# Altium schematic sheet Antena RF.SchDoc: Antena R/F
size A4; CompanyName: MUISE; Engineer: Manuel Viqueira Rodríguez; Organization: ETSI Telecomunicaciones; Address1: Av. Complutense, 30; Address2: , 28040 Madrid; Address3: Madrid; Address4: España; DocumentNumber: 4; Revision: V1.0; SheetNumber: 4; SheetTotal: 8; Engineer2: Marcos Vazquez Nuñez
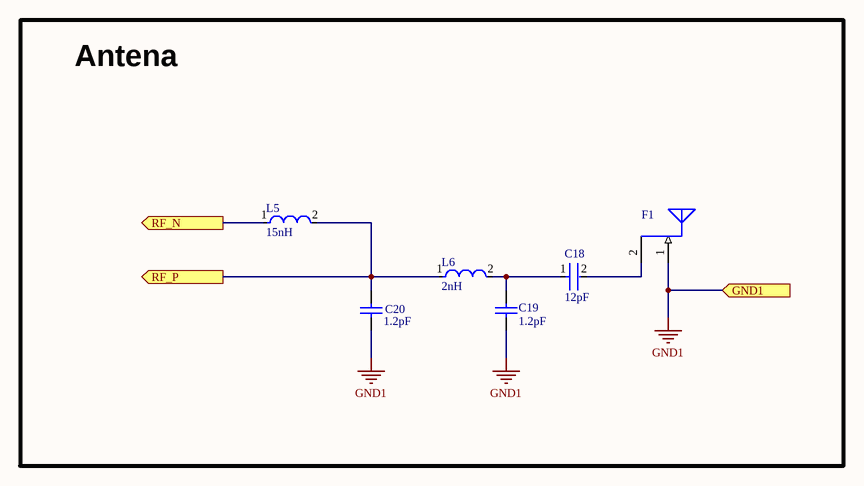
[diagram p0: Antena RF.SchDoc]

## Parts
C18  12pF  [FP-C0603C-CF-MFG]
C19  1.2pF  [CAPC1005X55X25ML05T10]
C20  1.2pF  [CAPC1005X55X25ML05T10]
F1  -  [PCBAntenna]  (value not drawn)  (net tie, no BOM)
L5  15nH  [FP-LQW15AN_00-W0_6-0_1-MFG]
L6  2nH  [FP-LQW15AN_00-W0_6-0_1-MFG]

## Blocks framed on the sheet
Antena: C18-C20 F1 L5 L6

## Ports
GND1 (in), RF_N (out), RF_P (out)

## Nets
GND1: C19.1 C20.1 F1.1(FeedPoint) ; port GND1
RF_N: L5.1 ; port RF_N
RF_P: C20.2 L5.2 L6.1 ; port RF_P
NetC18_1: C18.1 C19.2 L6.2
NetC18_2: C18.2 F1.2(GND)

## Notes on the sheet
- Size:
- Date:
- Title
- A4
- Number:
- Time:
- Revision:
- Sheet
- of
- Engineer
- File:

## Library data of the parts
C18 = CMP-1035-00616-2: CAP CER 12PF 50V NP0 0603; Manufacturer: KEMET; Manufacturer Part Number: C0603C120D5GACTU; Temperature Characteristic: C0G; Tolerance: 0.5 pF; Automotive Grade: Grade 1; Material: Ceramic; Temperature Coefficient: 30ppm/°C; Automotive: Yes; Temperature Range High: +125°C; Value: 12 pF; Package: C0603C-CF; Device Class L1: Passive Components; Temperature: -55°C to +125°C; Octopart: https://octopart.com/c0603c120d5gactu-kemet-9143898; Lead Free: Yes; ComponentLink2URL: https://api.kemet.com/component-edge/download/datasheet/C0603C100J5GACAUTO.pdf; Device Class L3: Ceramic Capacitors; Height: 0.87mm; Mouser Description: Multilayer Ceramic Capacitors MLCC - SMD/SMT 50volts 12pF C0G 0.5%; RoHS: TRUE; Digikey Description: CAP CER 12PF 50V NP0 0603; Capacitance: 12 pF; Voltage Rating: 50 V; Temperature Range Low: -55°C; Device Class L2: Capacitors; Category: Cap; ComponentLink2Description: Datasheet
C19 C20 = CMP-2008-04279-1: Manufacturer: Murata; Part Number: GRM1555C1H1R2BA01D
F1 = PCBAntenna: GND pin has a via to a GND plane that is not included in the footprint, but has to be included in the final PCB layout design.
L5 = CMP-2000-06595-2: Wire Wound RF Inductor 15nH ±5% 460mA 0.16Ω 0402 (1005); Test Frequency: 100MHz; DC Resistance (DCR): 160mR; Shielding: Unshielded; Q Factor: 30; Core Material: Air; Self Resonant Frequency: 5GHz; Resistor Type: Wirewound; DC Current: 460mA; Inductance: 15nH; Weight: 2.8E-05oz; Radiation Hardening: No; Depth: 0.7mm; Package Quantity: 10000; Case/Package: 0402; Packaging: Tape and Reel; Length: 1mm; Max DC Current: 460mA; Case Code (Imperial): 0402; Tolerance: 5%; Min Operating Temperature: -55°C; Lead Free: Lead Free; Width: 0.02inch; Case Code (Metric): 1005; Termination: SMD/SMT; Military Standard: Not; Current Rating: 460mA; Height: 0.5mm; Mount: Surface Mount; Max Operating Temperature: 125°C
L6 = CMP-06042-008059-1: Wire Wound RF Inductor 2.4nH ±0.1nH 850mA 0.05Ω 0402 (1005); Tolerance: 2%; Shielding: Unshielded; Core Material: Air; Current: 260mA; DC Resistance (DCR): 50mR; Q Factor: 20; Self Resonant Frequency: 15GHz; Test Frequency: 100MHz; Termination: SMD/SMT; Weight: 2.8E-05oz; Mount: Surface Mount; REACH SVHC: No SVHC; Current Rating: 850mA; Case/Package: 0402; Depth: 0.7mm; Packaging: Tape and Reel; Military Standard: Not; Radiation Hardening: No; Width: 0.02inch; DC Current: 850mA; Height: 0.5mm; Case Code (Metric): 1005; Inductance: 2.4nH; Package Quantity: 10000; Max DC Current: 850mA; Max Operating Temperature: 125°C; Lead Free: Lead Free; Min Operating Temperature: -55°C; Case Code (Imperial): 0402; Length: 1mm; Resistor Type: Wirewound